# EAGLE design led_board (EAGLE 9.2.0)
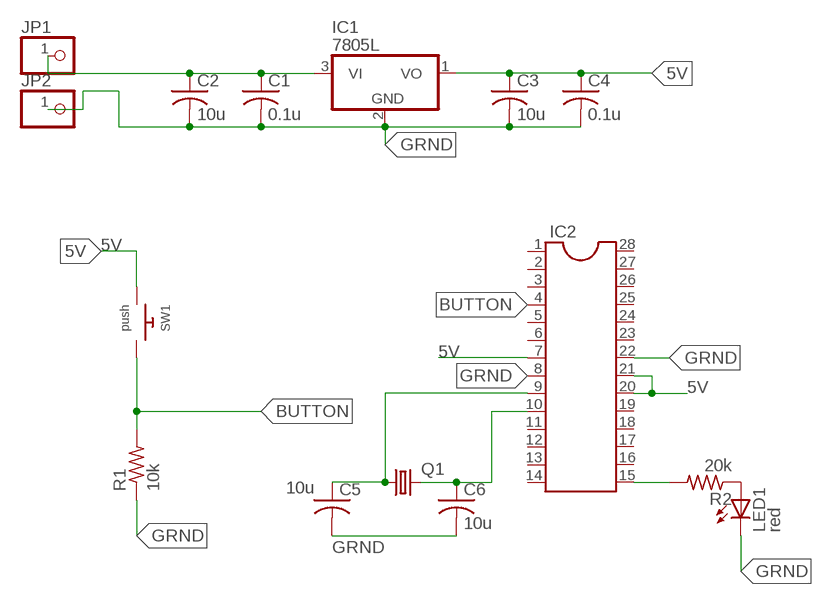
[diagram p0: schematic, sheet 1]

## Parts
C1  0.1u  C-USC0805  [C0805]
C2  10u  C-USC0805  [C0805]
C3  10u  C-USC0805  [C0805]
C4  0.1u  C-USC0805  [C0805]
C5  10u  C-USC0805  [C0805]
C6  10u  C-USC0805  [C0805]
IC1  7805L  [TO92]
IC2  DIL28  [DIL28-6]
JP1  PINHD-1X1  [1X01]
JP2  PINHD-1X1  [1X01]
LED1  red  LEDCHIPLED_0603  [CHIPLED_0603]
Q1  CRYSTALHC49S  [HC49/S]
R1  10k  R-US_M0805  [M0805]
R2  20k  R-US_M0805  [M0805]
SW1  push  SWITCH_PUSHBUTTONSOFTTOUCHSMD_SJ  [PUSHBUTTON_SMD_SJ]

## Nets
5V: C3.1 C4.1 IC1.1(VO) IC2.7 IC2.20 IC2.21 SW1.P$1
BUTTON: R1.2 SW1.P$2
GRND: C1.2 C2.2 C3.2 C4.2 C5.2 C6.2 IC1.2(GND) JP2.1 LED1.C R1.1
N$1: C1.1 C2.1 IC1.3(VI) JP1.1
N$2: IC2.22
N$3: LED1.A R2.1
N$4: C5.1 IC2.9 Q1.1
N$5: C6.1 IC2.10 Q1.2
N$7: IC2.15 R2.2
Unconnected: IC2.1 IC2.2 IC2.3 IC2.4 IC2.5 IC2.6 IC2.8 IC2.11 IC2.12 IC2.13 IC2.14 IC2.16 IC2.17 IC2.18 IC2.19 IC2.23 IC2.24 IC2.25 IC2.26 IC2.27 IC2.28

## Library data of the parts
C1-C6 = adafruit:C-US: CAPACITOR, American symbol
IC1 = adafruit:78*: Positive VOLTAGE REGULATOR Added bigger pads to the TO-92 package
IC2 = ic-package:DIL28: Dual In Line
JP1 JP2 = adafruit:PINHD-1X1: Pin header 1x1 for 0.1" spacing With round pins
LED1 = adafruit:LED: LED OSRAM: - CHIPLED LG R971, LG N971, LY N971, LG Q971, LY Q971, LO R971, LY R971 LH N974, LH R974 LS Q976, LO Q976, LY Q976 LO Q996 - Hyper CHIPLED LW Q18S LB Q993, LB Q99A, LB R99A - SideLED LS A670, LO A670, LY A670, LG A670, LP A670 LB A673, LV A673, LT A673, LW A673 LH A674 LY A675 LS A676, LA A676, LO A676, LY A676, LW A676 LS A679, LY A679, LG A679 - Hyper Micro SIDELED® LS Y876, LA Y876, LO Y876, LY Y876 LT Y87S - SmartLED LW L88C, LW L88S LB L89C, LB L89S, LG L890 LS L89K, LO L89K, LY L89K LS L896, LA L896, LO L896, LY L896 - TOPLED LS T670, LO T670, LY T670, LG T670, LP T670 LSG T670, LSP T670, LSY T670, LOP T670, LYG T670 LG T671, LOG T671, LSG T671 LB T673, LV T673, LT T673, LW T673 LH T674 LS T676, LA T676, LO T676, LY T676, LB T676, LH T676, LSB T676, LW T676 LB T67C, LV T67C, LT T67C, LS T67K, LO T67K, LY T67K, LW E67C LS E67B, LA E67B, LO E67B, LY E67B, LB E67C, LV E67C, LT E67C LW T67C LS T679, LY T679, LG T679 LS T770, LO T770, LY T770, LG T770, LP T770 LB T773, LV T773, LT T773, LW T773 LH T774 LS E675, LA E675, LY E675, LS T675 LS T776, LA T776, LO T776, LY T776, LB T776 LHGB T686 LT T68C, LB T68C - Hyper Mini TOPLED® LB M676 - Mini TOPLED Santana® LG M470 LS M47K, LO M47K, LY M47K Source: http://www.osram.convergy.de/
Q1 = adafruit:CRYSTAL: CRYSTAL; OC_FARNELL: 1667008; OC_NEWARK: unknown
R1 R2 = adafruit:R-US_: RESISTOR, American symbol
SW1 = adafruit:SWITCH_PUSHBUTTON: Buttons SOFTTOUCHSMD_SJ - Soft touch temporary push button (Super Junk Akihabara) Compatible with SKPMANE010 [Mouser: 688-SKPMAN] C&K_KSS = Digikey: KSS221GLFS

## Net classes
0 default: width 0.305 mm, drill 0.508 mm, clearance 0.305 mm

## Board
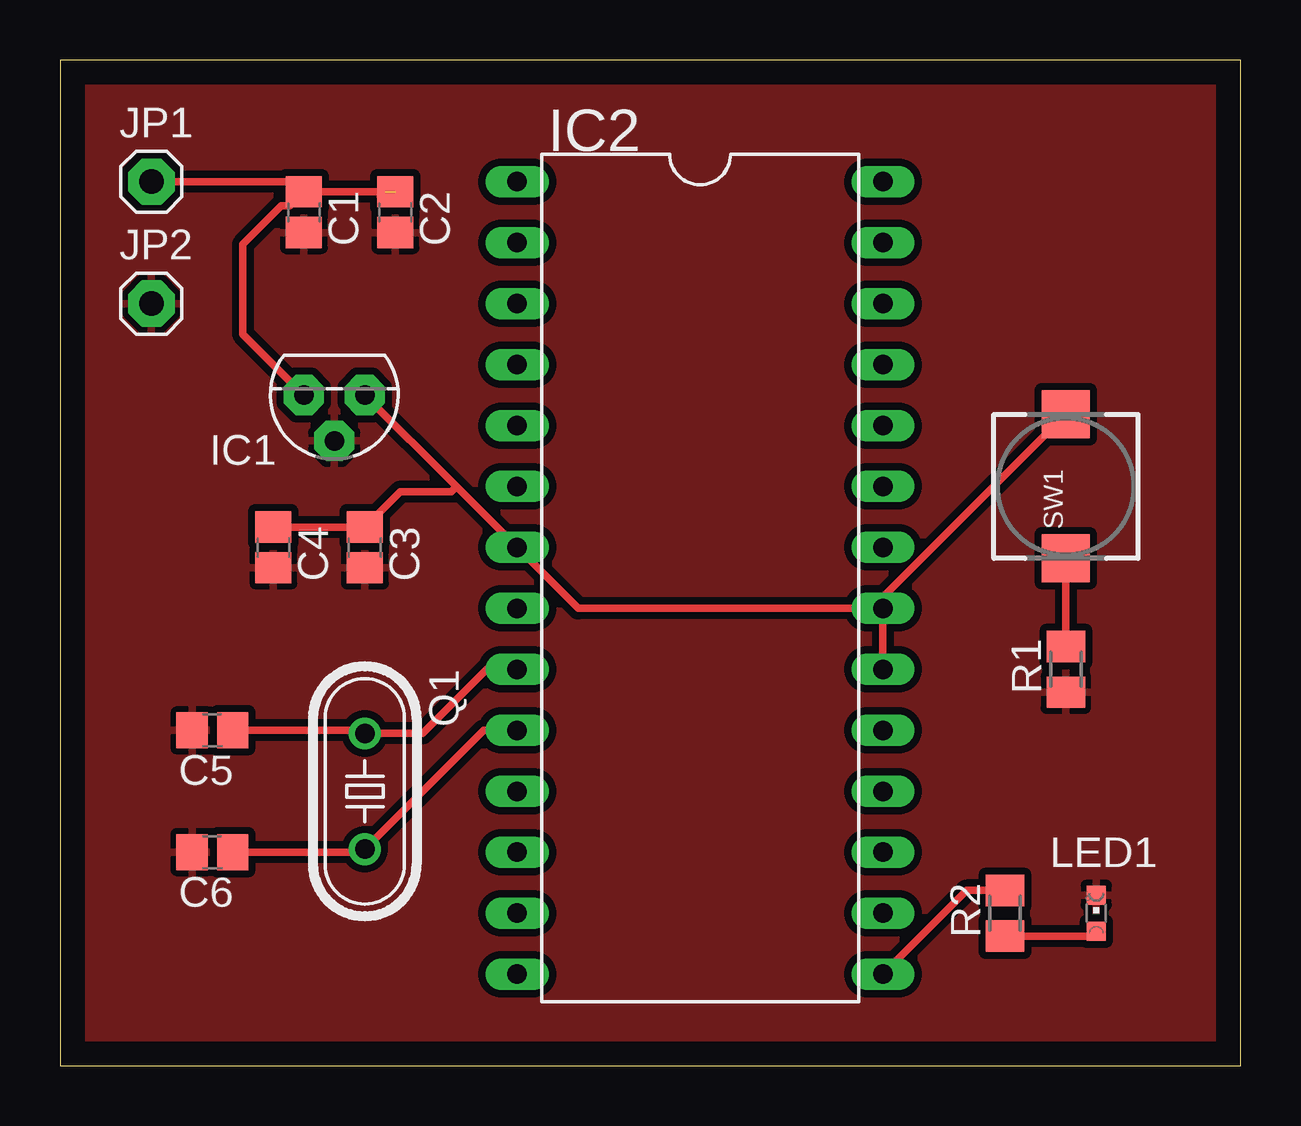
[diagram p1: board, top side]
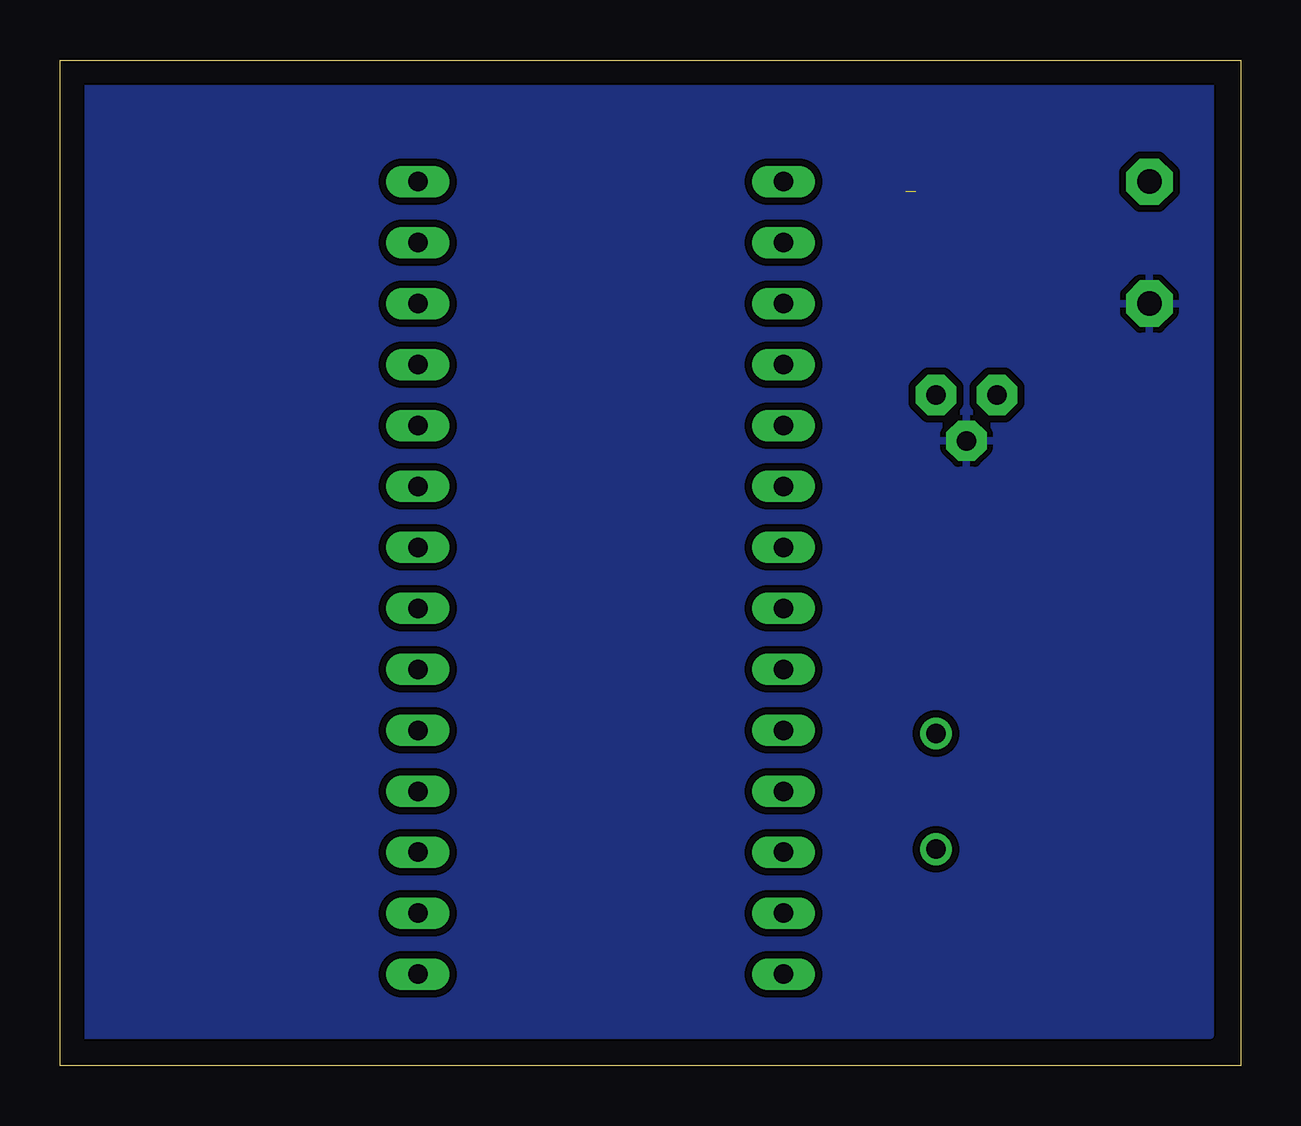
[diagram p2: board, bottom side, seen from below]

Size 49.2 x 41.9 mm. Coordinates in mm from the lower left corner, seen from the top.
Outline: 0,0 49.2,0 49.2,41.9 0,41.9 0,0
Copper layers (1*16): Top 0.035mm / dielectric 1.5mm / Bottom 0.035mm
Design rules "default": minimum track width 6mil, minimum drill 0.35mm, track to track 6mil, track to pad 6mil, pad to pad 6mil, via to via 6mil, smd to smd 6mil, copper to edge 40mil, drill to drill 6mil, minimum pad ring 10mil, minimum via ring 8mil, stop-mask expansion 4mil, vias tented up to drill 0mil, thermal gap 10mil

### Footprints (pad centres in the part's own frame; a part is rotated, then mirrored left to right if it is on the bottom)
C0805 = smd 1.3 x 1.5: 1 -0.85,0; 2 0.85,0
TO92 = drill 0.813 pad 1.676 octagon: 1 -1.27,0; 2 0,1.905; 3 1.27,0
DIL28-6 = drill 0.813 long: 1 -16.51,-7.62; 2 -13.97,-7.62; 3 -11.43,-7.62; 4 -8.89,-7.62; 5 -6.35,-7.62; 6 -3.81,-7.62; 7 -1.27,-7.62; 8 1.27,-7.62; 9 3.81,-7.62; 10 6.35,-7.62; 11 8.89,-7.62; 12 11.43,-7.62; 13 13.97,-7.62; 14 16.51,-7.62; 15 16.51,7.62; 16 13.97,7.62; 17 11.43,7.62; 18 8.89,7.62; 19 6.35,7.62; 20 3.81,7.62; 21 1.27,7.62; 22 -1.27,7.62; 23 -3.81,7.62; 24 -6.35,7.62; 25 -8.89,7.62; 26 -11.43,7.62; 27 -13.97,7.62; 28 -16.51,7.62
1X01 = drill 1.016 pad 1.93 octagon: 1 0,0
CHIPLED_0603 = smd 0.8 x 0.8: A 0,-0.75; C 0,0.75
HC49/S = drill 0.813: 1 -2.413,0; 2 2.413,0
M0805 = smd 1.3 x 1.6: 1 -0.95,0; 2 0.95,0
PUSHBUTTON_SMD_SJ = smd 2 x 2: P$1 3,0; P$2 -3,0

### Placement (x,y rotation side)
C1  10.16,35.56 270 top
C2  13.97,35.56 270 top
C3  12.7,21.59 270 top
C4  8.89,21.59 270 top
C5  6.35,13.97 180 top
C6  6.35,8.89 180 top
IC1  11.43,27.94 180 top
IC2  26.67,20.32 270 top
JP1  3.81,36.83 0 top
JP2  3.81,31.75 0 top
LED1  43.18,6.35 0 top
Q1  12.7,11.43 270 top
R1  41.91,16.51 90 top
R2  39.37,6.35 90 top
SW1  41.91,24.13 90 top

### Tracks (layer width: path | path; a pad name or v marks a point on that pad's centre or on a via)
5V
  Top 0.152: 12.84,22.58 C3.1
  Top 0.305: IC2.21 21.59,19.05 IC2.7 16.51,24.13 | IC2.21 IC2.20 | SW1.P$1 34.29,19.51 IC2.21 | C4.1 C3.1 14.18,23.92 16.3,23.92 16.51,24.13 | 16.51,24.13 IC1.1
BUTTON
  Top 0.305: SW1.P$2 R1.2
GRND
  pour Bottom: 1.27,53.34 58.42,53.34 58.42,1.27 1.27,1.27
  pour Top: 0,41.91 49.53,41.91 49.53,0 0,0
N$1  (1 unrouted)
  Top 0.305: 13.55,36.41 13.34,36.2 | JP1.1 9.74,36.83 C1.1 | 13.55,36.41 C1.1 | 13.97,36.83 13.55,36.41 | C1.1 9.57,35.82 9.22,35.82 7.62,34.22 7.62,30.48 IC1.3
N$3
  Top 0.305: LED1.A 43.38,5.4 R2.1
N$4
  Top 0.305: IC2.9 17.78,16.51 15.11,13.84 Q1.1 12.57,13.97 C5.1
N$5
  Top 0.305: IC2.10 17.65,13.97 Q1.2 12.57,8.89 C6.1
N$7
  Top 0.305: IC2.15 37.78,7.3 R2.2